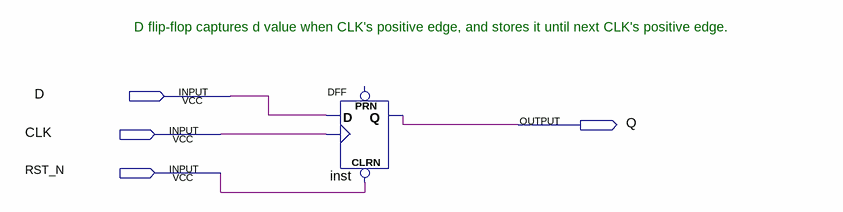
[diagram p0: schematic sheet]
// Quartus schematic practice1_1.bdf as structural Verilog: 1 symbols, 4 pins
module practice1_1 (
  input  D,
  input  CLK,
  input  RST_N,
  output Q
);

  DFF inst (.CLRN(RST_N), .CLK(CLK), .D(D), .Q(Q));  // open: PRN

  // Notes on the sheet:
  //   D flip-flop captures d value when CLK's positive edge, and stores it until next CLK's positive edge.
endmodule
